# Altium schematic sheet Sheet1.SchDoc
size A4; SheetNumber: 1; SheetTotal: 1
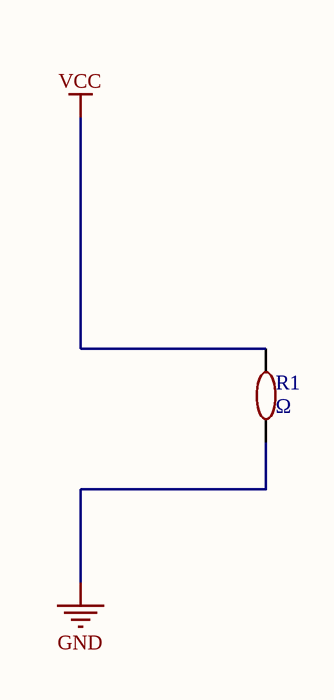
[diagram p0: Sheet1.SchDoc]

## Parts
R1  Ω  [0603]

## Nets
GND: R1.1
VCC: R1.2

## Library data of the parts
R1 = R0603: 0603封装电阻